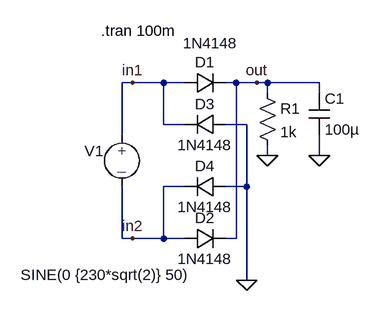
[diagram p0: schematic gleichrichter_graetz.asc]
gleichrichter_graetz.asc, the LTspice schematic file:
Version 4
SHEET 1 880 680
WIRE 80 144 64 144
WIRE 128 144 80 144
WIRE 160 144 128 144
WIRE 240 144 224 144
WIRE 272 144 240 144
WIRE 288 144 272 144
WIRE 368 144 288 144
WIRE 288 160 288 144
WIRE 368 160 368 144
WIRE 128 208 128 144
WIRE 160 208 128 208
WIRE 256 208 224 208
WIRE 64 224 64 144
WIRE 288 256 288 240
WIRE 368 256 368 224
WIRE 160 304 128 304
WIRE 256 304 256 208
WIRE 256 304 224 304
WIRE 64 384 64 304
WIRE 80 384 64 384
WIRE 128 384 128 304
WIRE 128 384 80 384
WIRE 160 384 128 384
WIRE 240 384 240 144
WIRE 240 384 224 384
WIRE 256 448 256 304
FLAG 288 256 0
FLAG 80 144 in1
FLAG 272 144 out
FLAG 368 256 0
FLAG 80 384 in2
FLAG 256 448 0
SYMBOL source-V 64 208 R0
WINDOW 0 -58 41 Left 2
WINDOW 3 -156 232 Left 2
WINDOW 123 0 0 Left 2
WINDOW 39 0 0 Left 2
SYMATTR InstName V1
SYMATTR Value SINE(0 {230*sqrt(2)} 50)
SYMBOL res 272 144 R0
SYMATTR InstName R1
SYMATTR Value 1k
SYMBOL diode 160 160 R270
WINDOW 0 32 32 VTop 2
WINDOW 3 93 40 VBottom 2
SYMATTR InstName D1
SYMATTR Value 1N4148
SYMBOL cap 352 160 R0
SYMATTR InstName C1
SYMATTR Value 100µ
SYMBOL diode 160 400 R270
WINDOW 0 32 32 VTop 2
WINDOW 3 0 32 VBottom 2
SYMATTR InstName D2
SYMATTR Value 1N4148
SYMBOL diode 224 224 M270
WINDOW 0 32 32 VTop 2
WINDOW 3 0 32 VBottom 2
SYMATTR InstName D3
SYMATTR Value 1N4148
SYMBOL diode 224 320 M270
WINDOW 0 32 32 VTop 2
WINDOW 3 0 32 VBottom 2
SYMATTR InstName D4
SYMATTR Value 1N4148
TEXT 32 64 Left 2 !.tran 100m

The netlist it stands for:
* gleichrichter_graetz.asc
V1 in1 in2 SINE(0 {230*sqrt(2)} 50)
R1 out 0 1k
D1 in1 out 1N4148
C1 out 0 100µ
D2 in2 out 1N4148
D3 0 in1 1N4148
D4 0 in2 1N4148
.model D D
.lib standard.dio
.tran 100m
.backanno
.end